# EAGLE design NinjaPCRf-131101 (EAGLE 6.3)
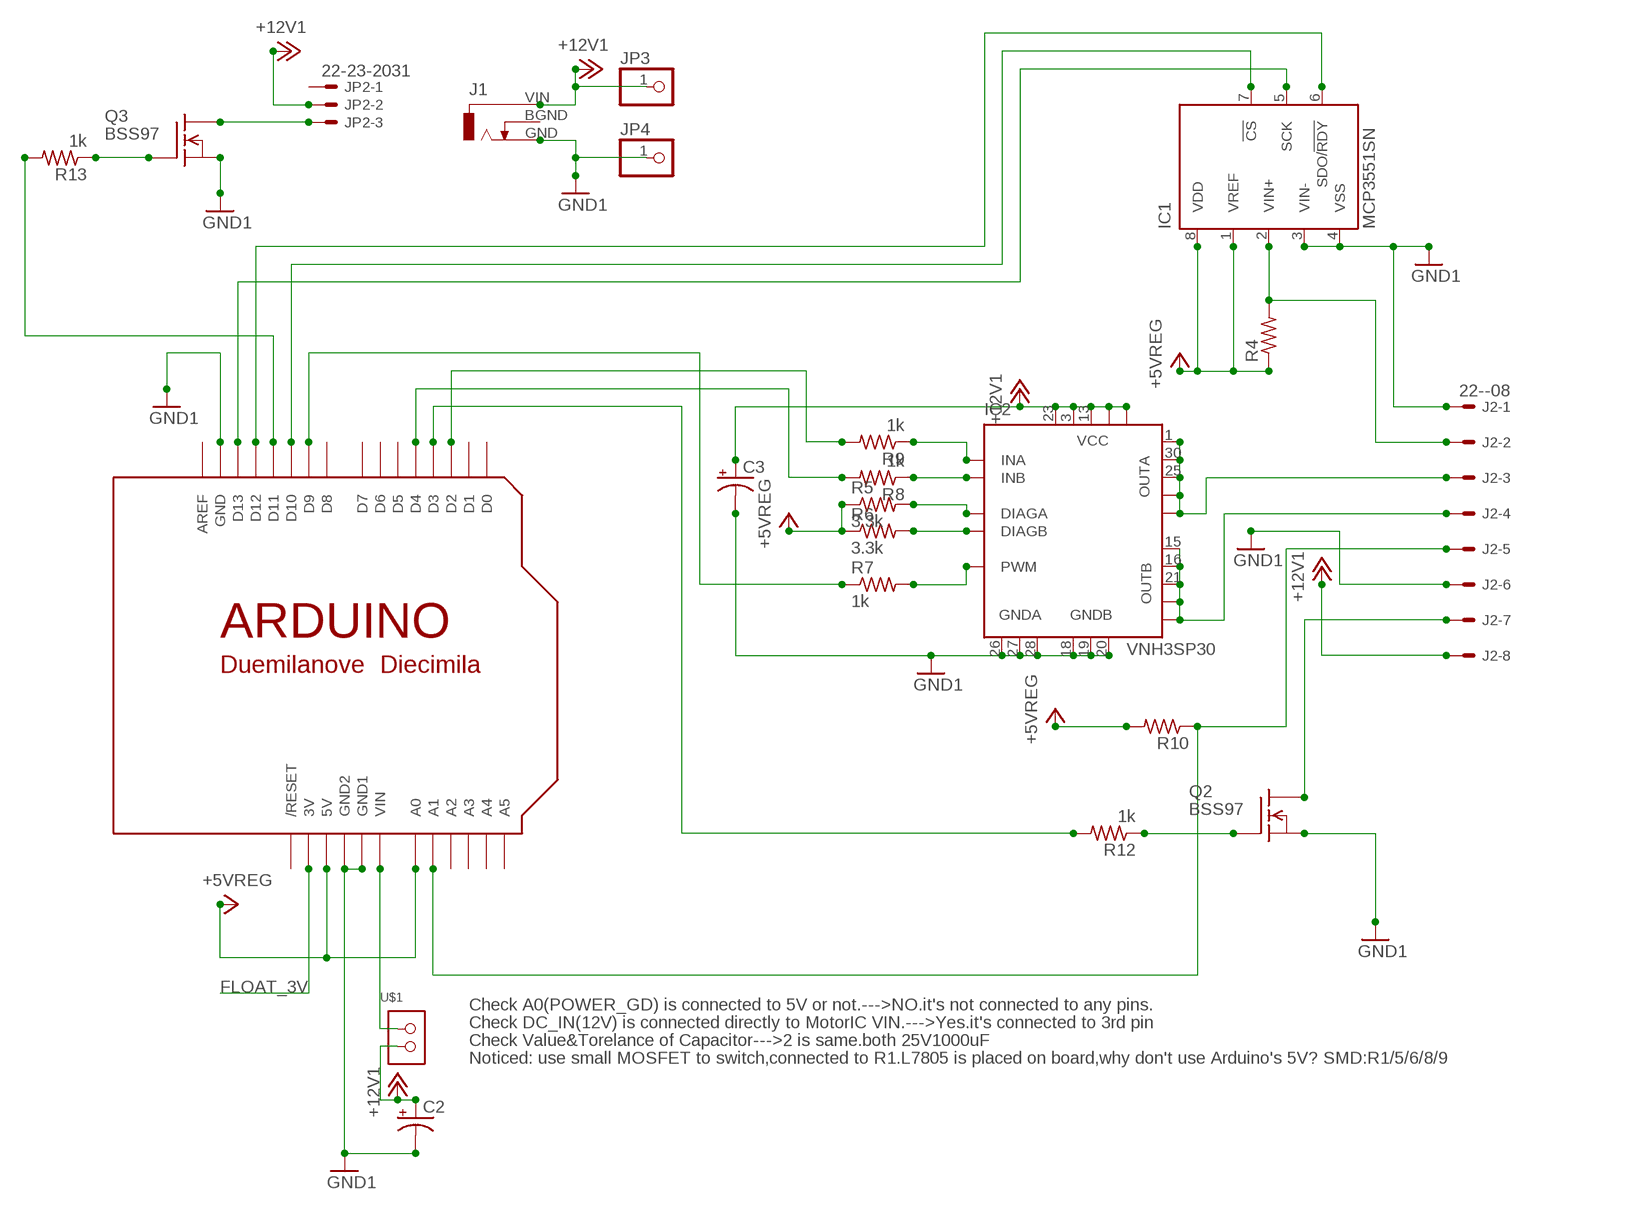
[diagram p0: schematic, sheet 1]

## Parts
C2  CPOL-USE5-8.5  [E5-8,5]
C3  CPOL-USE5-13  [E5-13]
IC1  MCP3551SN  [SO-08]
IC2  VNH3SP30  [MULTIPOWERSO-30]
J1  DCJ0303  [DCJ0303]
J2  22--08  [POLOLU-8-VERTICAL]
JP2  22-23-2031  [22-23-2031]
JP3  PINHD-1X1  [1X01]
JP4  PINHD-1X1  [1X01]
Q2  BSS97  [TO202]
Q3  BSS97  [TO202]
R4  R-US_R0603  [R0603]
R5  3.3k  R-US_R0603  [R0603]
R6  3.3k  R-US_R0603  [R0603]
R7  1k  R-US_R0603  [R0603]
R8  1k  R-US_R0603  [R0603]
R9  1k  R-US_R0603  [R0603]
R10  R-US_R0603  [R0603]
R12  1k  R-US_R0603  [R0603]
R13  1k  R-US_R0603  [R0603]
U$1  1X02  [1X02_1.1_UNSIGNED]
U$3  ARDUINONS  [ARDUINO-NOSILK]

## Nets
+5VREG [2A]: IC1.1(VREF) IC1.8(VDD) R4.1 R5.1 R6.1 R10.2 U$3.5V U$3.A0
+12V1 [8A]: C2.+ C3.+ IC2.3(VCC) IC2.13(VCC) IC2.23(VCC) IC2.VCC IC2.VCC@1(VCC) J1.VIN J2.8 JP2.2 JP3.1 U$1.2
D13: IC1.5(SCK) U$3.D13
FLOAT_3V: U$3.3V
GND1 [2A]: C2.- C3.- IC1.3(VIN-) IC1.4(VSS) IC2.18(GNDB) IC2.19(GNDB) IC2.20(GNDB) IC2.26(GNDA) IC2.27(GNDA) IC2.28(GNDA) J1.GND J2.1 J2.6 JP4.1 Q2.1(S) Q3.1(S) U$3.GND U$3.GND1 U$3.GND2
N$1: J2.7 Q2.2(D)
N$2: JP2.3 Q3.2(D)
N$3: Q3.3(G) R13.1
N$4: R13.2 U$3.D11
N$5: U$1.1 U$3.VIN
N$8: R12.2 U$3.D3
N$12: IC2.8(PWM) R7.2
N$17: IC2.11(INB) R8.1
N$19: IC2.5(INA) R9.1
N$23: IC1.2(VIN+) J2.2 R4.2
N$25 [8A]: IC2.1(OUTA) IC2.25(OUTA) IC2.30(OUTA) IC2.OUTA IC2.OUTA@1(OUTA) J2.3
N$27: IC1.6(SDO/!RDY) U$3.D12
N$29: IC1.7(!CS) U$3.D10
N$31: R8.2 U$3.D4
N$32 [8A]: IC2.15(OUTB) IC2.16(OUTB) IC2.21(OUTB) IC2.OUTB IC2.OUTB@1(OUTB) J2.4
N$33: R9.2 U$3.D2
N$34: IC2.6(DIAGA) R5.2
N$35: IC2.10(DIAGB) R6.2
N$37: J2.5 R10.1 U$3.A1
S$2: R7.1 U$3.D9
T1: Q2.3(G) R12.1
Unconnected: J1.BGND JP2.1 U$3.A2 U$3.A3 U$3.A4 U$3.A5 U$3.AREF U$3.D0 U$3.D1 U$3.D5 U$3.D6 U$3.D7 U$3.D8 U$3.RESET(/RESET)

## Notes on the sheet
- Check A0(POWER_GD) is connected to 5V or not.--->NO.it's not connected to any pins.
- Check DC_IN(12V) is connected directly to MotorIC VIN.--->Yes.it's connected to 3rd pin
- Check Value&Torelance of Capacitor--->2 is same.both 25V1000uF
- Noticed: use small MOSFET to switch,connected to R1.L7805 is placed on board,why don't use Arduino's 5V? SMD:R1/5/6/8/9

## Library data of the parts
C2 C3 = rcl:CPOL-US: POLARIZED CAPACITOR, American symbol
IC1 = microchip:MCP355*: Low-Power, Single-Channel 22-Bit Delta-Sigma ADCs Source: http://ww1.microchip.com/downloads/en/DeviceDoc/21950c.pdf; MPN: MCP3551-E/SN; OC_FARNELL: 1084625; OC_NEWARK: 97K4494
IC2 = st-microelectronics:VNH3SP30: FULLY INTEGRATED H-BRIDGE MOTOR DRIVER Source: http://pdf1.alldatasheet.com/datasheet-pdf/view/84563/STMICROELECTRONICS/VNH3SP30.html; MPN: VNH3SP30-E; OC_FARNELL: 1739420; OC_NEWARK: 33R1486
J1 = JACK:DCJ0303: DC POWER JACK Source: DCJ0303.pdf; OC_FARNELL: unknown; OC_NEWARK: unknown
J2 = con-molex:22-?-08: CONNECTOR wire to board 2.54 mm (.1 inch) pitch header
JP2 = con-molex:22-23-2031: .100" (2.54mm) Center Header - 3 Pin; MF: MOLEX; MPN: 22-23-2031; OC_FARNELL: 1462950; OC_NEWARK: 30C0862
JP3 JP4 = pinhead:PINHD-1X1: PIN HEADER
Q2 Q3 = openpcr:BSS97: N-Channel Enhancement MOSFET 200V; 1.5A; 1,6Ohm
R4 R10 R12 R13 = resistor:R-US_: RESISTOR, American symbol
R5-R9 = rcl:R-US_: RESISTOR, American symbol
U$1 = PIN:1X02
U$3 = openpcr:ARDUINO: Arduino Diecimila/Duemilanove Make a shield with ease, this package has all the named pins as well as the two mounting drill holes and an outline of the USB and DC power connector. The outline is on the DIMENSION layer, so if your board house uses it they will cut the outline to match. http://www.ladyada.net/library/pcb/eaglelibrary.html

## Net classes
0 default: width 0.381 mm
1 2A: width 0.406 mm
2 8A: width 2.54 mm
3 3A: width 1.016 mm

## Board
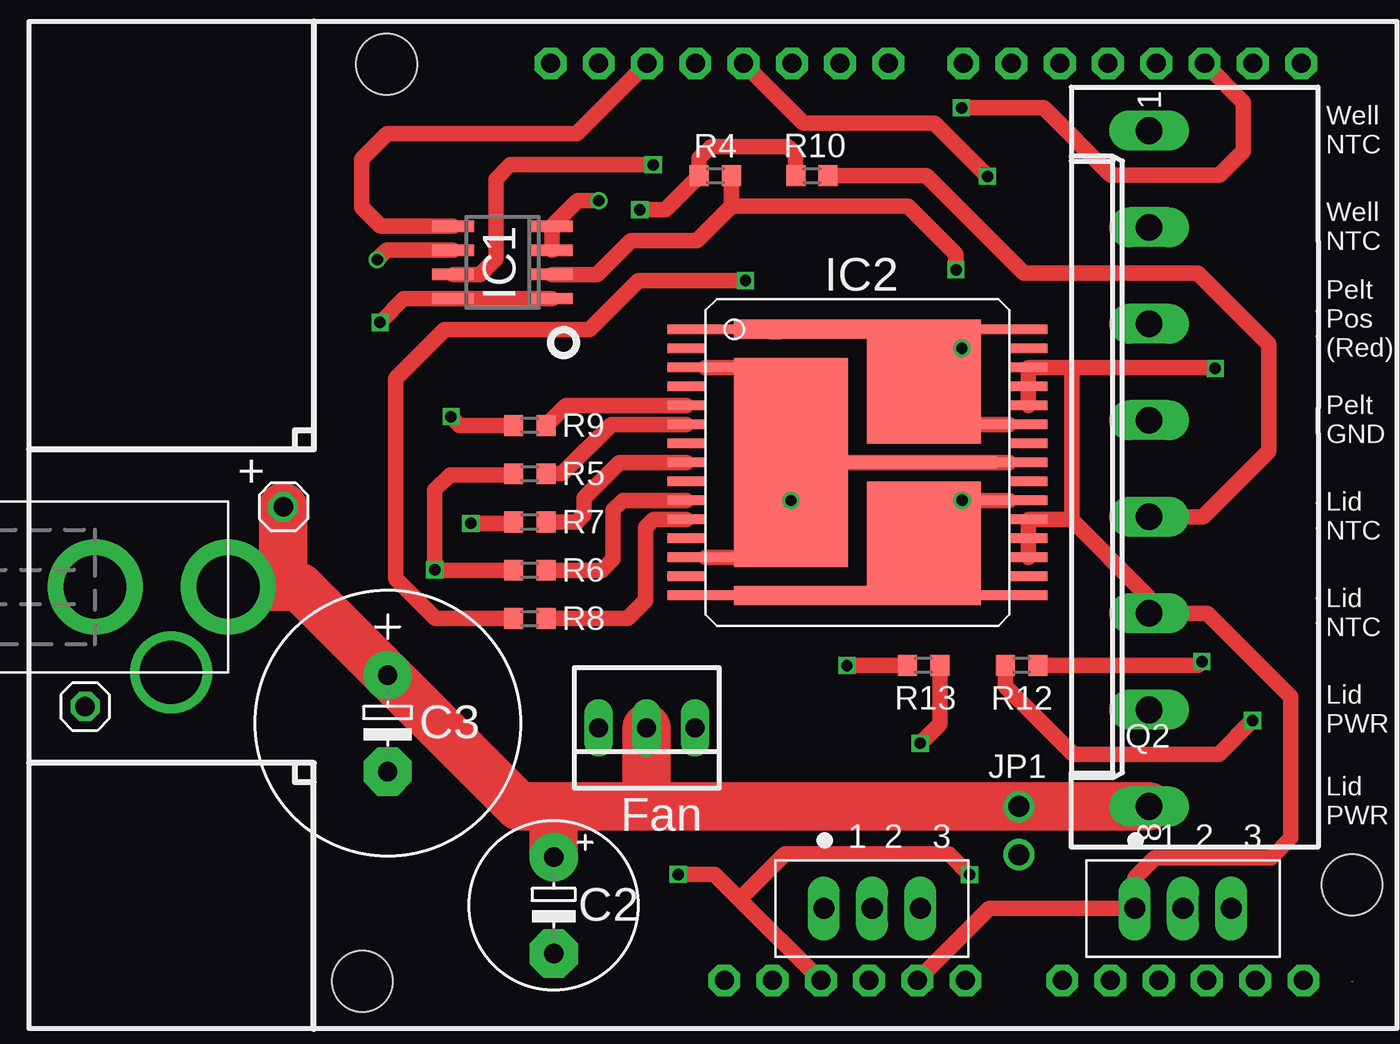
[diagram p1: board, top side]
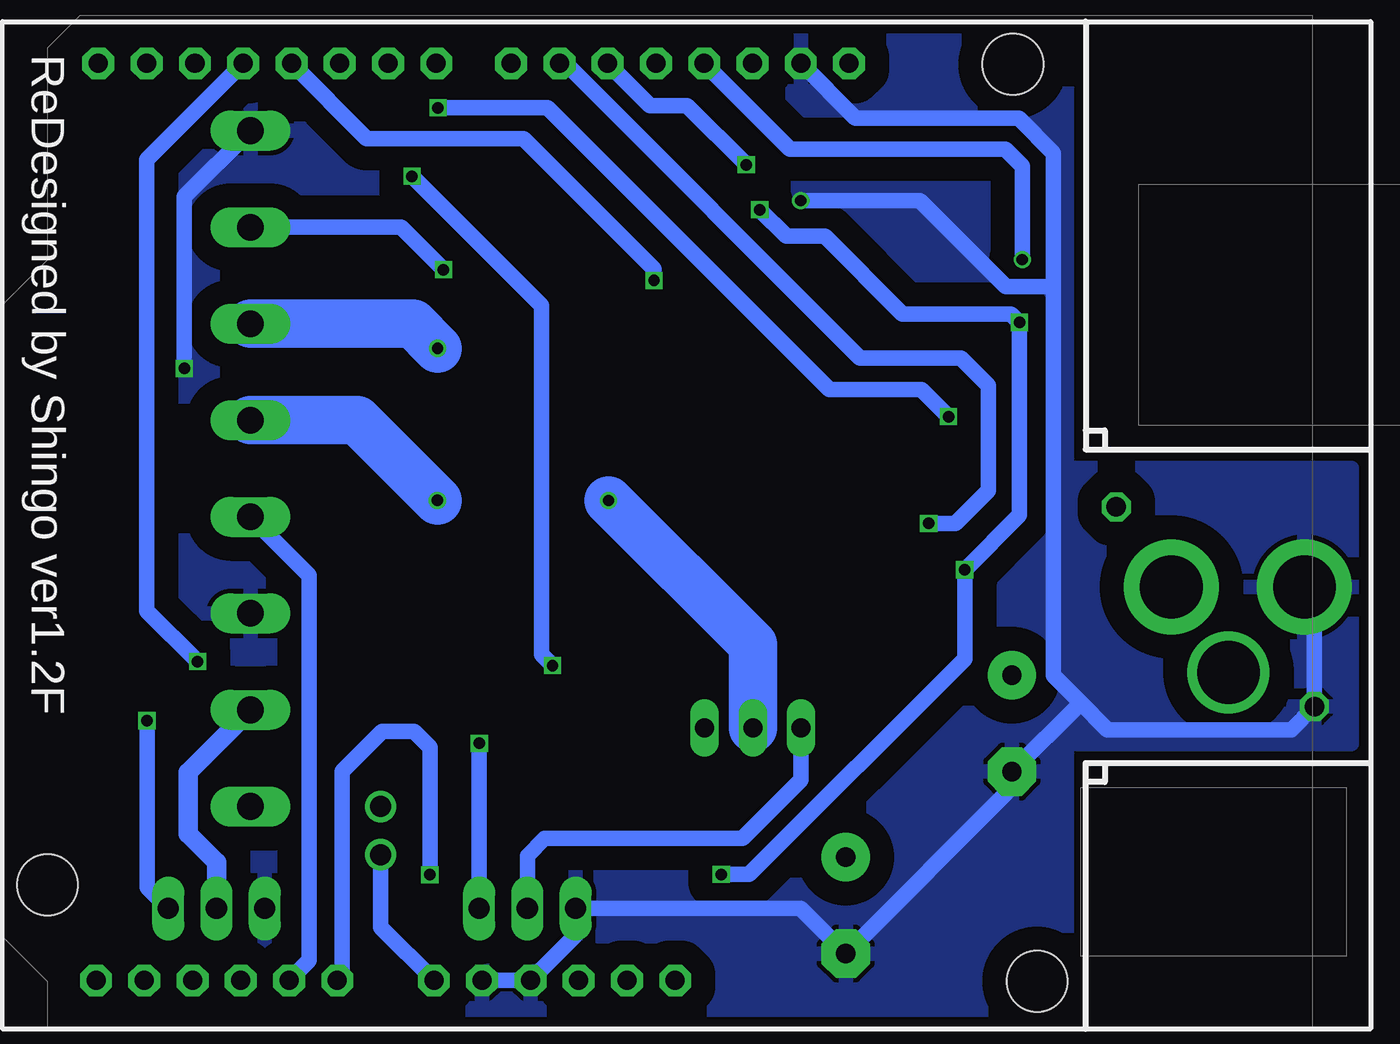
[diagram p2: board, bottom side, seen from below]

No outline drawn. Coordinates in mm, seen from the top.
Copper layers (1*16): Top 0.035mm / dielectric 1.5mm / Bottom 0.035mm
Design rules "Fusion_eagle_rule_v1.1": minimum track width 6mil, minimum drill 12mil, track to track 6mil, track to pad 6mil, pad to pad 6mil, via to via 6mil, smd to smd 0mil, copper to edge 10mil, drill to drill 10mil, minimum pad ring 10mil, minimum via ring 6mil, stop-mask expansion 2mil, vias tented up to drill 100mil, thermal gap 10mil

### Footprints (pad centres in the part's own frame; a part is rotated, then mirrored left to right if it is on the bottom)
E5-8,5 = drill 1.016 pad 2.54: + -2.54,0 | drill 1.016 pad 2.54 octagon: - 2.54,0
E5-13 = drill 1.016 pad 2.54: + -2.54,0 | drill 1.016 pad 2.54 octagon: - 2.54,0
SO-08 = smd 0.6 x 2.2: 1 -1.905,-2.6; 2 -0.635,-2.6; 3 0.635,-2.6; 4 1.905,-2.6; 5 1.905,2.6; 6 0.635,2.6; 7 -0.635,2.6; 8 -1.905,2.6
MULTIPOWERSO-30 = smd 0.508 x 12: 1 -7,-4; 15 7,-4; 16 7,4; 30 -7,4 | smd 0.508 x 2: 2 -6,-9; 4 -4,-9; 5 -3,-9; 6 -2,-9; 7 -1,-9; 8 0,-9; 9 1,-9; 10 2,-9; 11 3,-9; 12 4,-9; 14 6,-9; 17 6,9; 18 5,9; 19 4,9; 20 3,9; 22 1,9; 24 -1,9; 26 -3,9; 27 -4,9; 28 -5,9; 29 -6,9 | smd 0.508 x 4: 3 -5,-8; 13 5,-8; 21 2,8; 23 0,8; 25 -2,8 | smd 6.5 x 6: OUTA -4.25,3.5; OUTB 4.25,3.5 | smd 1 x 7.5: OUTA@1 -7,-2.755; OUTB@1 7,-2.755 | smd 11 x 6: VCC 0,-3.5 | smd 0.65 x 8.3: VCC@1 0,3.145
DCJ0303 = drill 3.3 pad 4: BGND 4.5,-3 | drill 3.3 pad 5: GND 0,-7; VIN 0,0
POLOLU-8-VERTICAL = drill 1.4 long: 1 17.78,0; 2 12.7,0; 3 7.62,0; 4 2.54,0; 5 -2.54,0; 6 -7.62,0; 7 -12.7,0; 8 -17.78,0
22-23-2031 = drill 1 long: 1 -2.54,0; 2 0,0; 3 2.54,0
1X01 = drill 1.016 octagon: 1 0,0
TO202 = drill 1.118 long: 1 -2.54,-5.08; 2 0,-5.08; 3 2.54,-5.08
R0603 = smd 1 x 1.1: 1 -0.85,0; 2 0.85,0
1X02_1.1_UNSIGNED = drill 1.1: 1 -2.54,0; 2 0,0
ARDUINO-NOSILK = drill 1 pad 1.676 octagon: 3V 36.068,2.54; 5V 38.608,2.54; A0 51.308,2.54; A1 53.848,2.54; A2 56.388,2.54; A3 58.928,2.54; A4 61.468,2.54; A5 64.008,2.54; AREF 24.384,50.8; D0 63.881,50.8; D1 61.341,50.8; D2 58.801,50.8; D3 56.261,50.8; D4 53.721,50.8; D5 51.181,50.8; D6 48.641,50.8; D7 46.101,50.8; D8 42.164,50.8; D9 39.624,50.8; D10 37.084,50.8; D11 34.544,50.8; D12 32.004,50.8; D13 29.464,50.8; GND 26.924,50.8; GND1 43.688,2.54; GND2 41.148,2.54; RESET 33.528,2.54; VIN 46.228,2.54 | hole 3.2: 15.758,50.754; 66.558,7.574; 14.488,2.494

### Placement (x,y rotation side)
C2  27.62,6.5 270 top
C3  18.88,16.07 270 top
IC1  24.93,40.33 90 top
IC2  43.61,29.81 270 top
J1  10.49,23.25 270 top
J2  58.95,29.48 90 top
JP2  32.52,15.83 180 top
JP3  13.4,27.46 0 top
JP4  2.96,16.95 0 top
Q2  60.74,11.41 0 top
Q3  44.38,11.41 0 top
R4  36.13,44.88 0 top
R5  26.36,29.21 0 top
R6  26.36,24.13 0 top
R7  26.36,26.67 0 top
R8  26.36,21.59 180 top
R9  26.36,31.75 180 top
R10  41.21,44.88 180 top
R12  52.24,19.12 0 top
R13  47.08,19.12 180 top
U$1  52.1,11.7 90 top
U$3  3.07,0 0 top

### Tracks (layer width: path | path; a pad name or v marks a point on that pad's centre or on a via)
+5VREG  (via drill 0.6)
  Top 0.813: IC1.1 IC1.8 19.74,38.42 v18.48,37.17 | U$3.5V 37.42,6.79 | 37.42,6.79 36.09,8.12 v34.18,8.12 | R6.1 21.37,24.13 v21.37,24.16 21.37,28.35 22.16,29.14 25.45,29.14 R5.1 | v32.16,43.1 33.5,43.1 R4.1 35.28,45.81 35.89,46.42 39.96,46.42 40.36,46.02 R10.2 | 37.42,6.79 37.42,6.83 39.8,9.2 48.41,9.2 v49.51,8.11
  Bottom 0.813: v34.18,8.12 32.72,8.12 21.37,19.47 v21.37,24.16 18.48,27.04 v18.48,37.17 18.93,37.61 24.64,37.61 28.73,41.7 30.75,41.7 v32.16,43.1 | U$3.A0 54.12,2.79 54.12,13.55 52.02,15.65 50.35,15.65 49.51,14.8 v49.51,8.11
+12V1  (via drill 0.6)
  Top 0.813: IC2.3 40.11,34.81 IC2.VCC | IC2.VCC v40.1,27.8 40.1,24.81 IC2.13 | IC2.VCC IC2.VCC@1 IC2.23
  Top 2.54: J1.VIN 13.4,23.25 | 13.4,23.25 14.25,23.25 C3.+ 25.8,11.7 27.62,11.7 | 27.62,11.7 32.52,11.7 | U$1.2 52.62,11.7 | 52.62,11.7 J2.8 | C2.+ 27.62,11.7 | JP2.2 32.52,11.7 | JP3.1 13.4,23.25 | 32.52,11.7 52.62,11.7
  Bottom 2.54: JP2.2 32.52,20.21 v40.1,27.8
D13
  Top 0.813: U$3.D13 28.83,47.09 18.85,47.09 17.52,45.76 17.52,43.23 18.51,42.23 IC1.5
GND1  (via drill 0.6)
  Top 0.813: U$3.GND1 50.55,6.33 Q2.1 58.2,7.94 59.26,9 65.38,9 66.42,10.04 66.42,17.46 62.02,21.86 J2.6 58.95,22.7 54.75,26.9 | IC1.3 IC1.4 28.87,43.58 v29.99,43.58 | v62.43,34.75 62.37,34.81 54.62,34.81 | 54.62,34.81 IC2.28 IC2.27 IC2.26 | IC2.18 IC2.19 IC2.20 54.65,26.81 54.75,26.9 | 54.75,26.9 54.88,27.04 54.88,34.54 54.62,34.81
  Bottom 0.813: J1.GND 2.96,22.72 JP4.1 4.18,15.74 13.85,15.74 15.31,17.2 | 15.31,17.2 16.7,18.58 16.7,39.05 | 16.7,39.05 16.7,46.08 18.52,47.91 27.1,47.91 U$3.GND | 15.31,17.2 15.31,17.11 C3.- 18.89,12.69 C2.- 30,6.33 Q3.1 41.84,4.92 U$3.GND2 U$3.GND1 | v29.99,43.58 23.72,43.58 19.2,39.05 16.7,39.05 | J2.1 62.43,43.78 v62.43,34.75
  pour Bottom (isolate 1.27): 16,52 71,52 71,1 16,1 16,15 1,15 1,29.5 16,29.5
N$1
  Bottom 1.016: J2.7 62.24,13.49 62.24,10.25 60.74,8.75 Q2.2
N$2
  Bottom 0.813: JP2.3 29.98,13.1 33.05,10.02 43.47,10.02 44.38,9.11 Q3.2
N$3  (via drill 0.6)
  Top 0.813: R13.1 47.94,16.05 v46.91,15.02
  Bottom 0.813: v46.91,15.02 46.91,6.34 Q3.3
N$4  (via drill 0.6)
  Top 0.813: U$3.D11 40.76,47.66 47.65,47.66 v50.45,44.86 | v43.05,19.11 R13.2
  Bottom 0.813: v50.45,44.86 43.63,38.04 43.63,19.7 v43.05,19.11
N$5
  Bottom 0.813: U$3.VIN 52.1,5.34 U$1.1
N$8  (via drill 0.6)
  Top 0.813: R12.2 61.53,19.12 v61.73,19.32
  Bottom 0.813: v61.73,19.32 64.4,22 64.4,45.73 U$3.D3
N$12
  Top 0.813: R7.2 28.84,26.67 29.22,27.05 29.22,27.93 31.09,29.81 IC2.8
N$17
  Top 0.813: R8.1 31.51,21.59 32.45,22.53 32.45,26.38 32.88,26.81 IC2.11
N$19
  Top 0.813: R9.1 28.27,32.81 IC2.5
N$23  (via drill 0.6)
  Top 0.813: R4.2 36.98,43.29 | 36.98,43.29 35.17,41.48 31.7,41.48 29.91,39.69 IC1.2 | 36.98,43.29 46.26,43.29 48.79,40.76 v48.79,39.95
  Bottom 0.813: v48.79,39.95 51.02,42.18 J2.2
N$25  (via drill 0.6)
  Top 0.813: v49.1,35.8 48.1,36.81 IC2.30 IC2.OUTA@1 IC2.1 | IC2.1 39.22,36.81 39.09,36.67 39.48,36.67 IC2.1 | IC2.OUTA 47.35,34.06 v49.1,35.8 | v49.1,35.8 49.1,31.81 IC2.25
  Bottom 2.54: J2.3 50.4,37.1 v49.1,35.8
N$27  (via drill 0.6)
  Top 0.813: v18.34,40.47 18.82,40.96 IC1.6
  Bottom 0.813: U$3.D12 30.55,46.28 19.21,46.28 18.34,45.4 v18.34,40.47
N$29  (via drill 0.6)
  Top 0.813: IC1.7 23.74,39.69 24.58,40.53 24.58,44.71 25.33,45.46 v32.85,45.46 v32.86,45.47
  Bottom 0.813: U$3.D10 37.93,48.58 35.97,48.58 v32.86,45.47
N$31  (via drill 0.6)
  Top 0.813: R8.2 21.41,21.59 19.3,23.7 19.3,34.23 21.88,36.8 29.52,36.8 32.09,39.37 v37.72,39.37
  Bottom 0.813: v37.72,39.37 37.72,39.99 44.57,46.84 52.83,46.84 U$3.D4
N$32  (via drill 0.6)
  Top 0.813: IC2.21 v49.11,27.81 v49.11,27.8 47.11,27.8 IC2.OUTB 47.61,25.56 IC2.16 IC2.OUTB@1 IC2.15
  Bottom 2.54: J2.4 53.33,32.02 v49.11,27.8
N$33  (via drill 0.6)
  Top 0.813: R9.2 22.68,31.75 v22.22,32.21 | U$3.D2 63.91,48.76 63.91,46.19 62.65,44.93 56.95,44.93 53.41,48.47 v49.08,48.47
  Bottom 0.813: v22.22,32.21 23.64,33.64 28.49,33.64 43.31,48.47 v49.08,48.47
N$34
  Top 0.813: R5.2 28.07,29.21 30.66,31.81 IC2.6
N$35
  Top 0.813: R6.2 30.17,24.13 30.75,24.72 30.75,27.3 31.27,27.81 IC2.10
N$37
  Top 0.813: R10.1 47.22,44.88 52.35,39.75 61.52,39.75 65.24,36.03 65.24,30.39 61.79,26.94 J2.5
  Bottom 0.813: U$3.A1 55.85,3.61 55.85,23.84 J2.5
S$2  (via drill 0.6)
  Top 0.813: R7.1 25.44,26.59 v23.26,26.59
  Bottom 0.813: v23.26,26.59 21.86,26.59 20.11,28.34 20.11,33.86 21.56,35.3 26.87,35.3 42.36,50.8 U$3.D9
T1  (via drill 0.6)
  Top 0.813: v64.39,16.22 62.62,14.44 54.97,14.44 51.4,18.01 R12.1
  Bottom 0.813: Q2.3 64.39,7.45 v64.39,16.22

### Text on the board
tPlace: R4 | R10 | Well / NTC | IC1 | Well / NTC | IC2 | Pelt / Pos / (Red) | R9 | Pelt / GND | + | R5 | R7 | Lid / NTC | R6 | R8 | Lid / NTC | R13 | R12 | Lid / PWR | C3 | Q2 | JP1 | Lid / PWR | Fan | C2
bPlace: ReDesigned by Shingo ver1.2F